# Altium schematic sheet Sheet.SchDoc
size A4; SheetNumber: 1; SheetTotal: 1
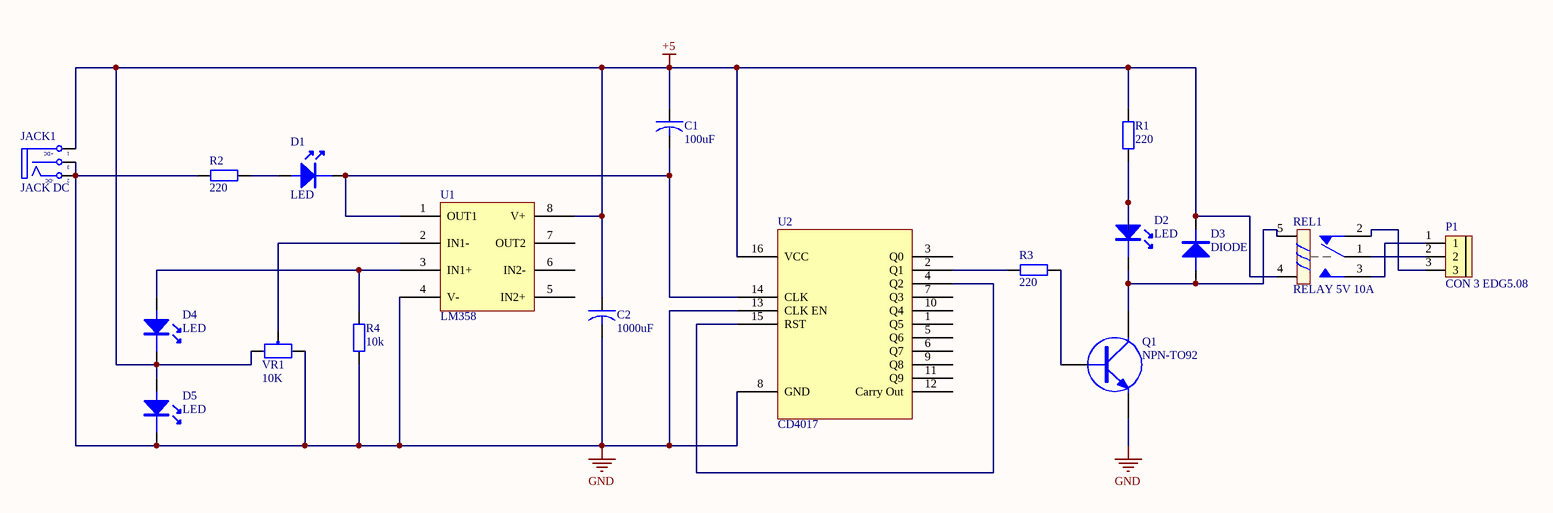
[diagram p0: Sheet.SchDoc]

## Parts
C1  100uF  [TU HOA 8mm]
C2  1000uF  [TU HOA 8mm]
D1  LED  [LED5MM RED]
D2  LED  [LED5MM RED]
D3  DIODE  [DIODE 1A]
D4  LED  [LED5MM RED]
D5  LED  [LED5MM RED]
JACK1  JACK DC  [JACK DC]
P1  CON 3 EDG5.08  [CON 3P 5.08MM]
Q1  NPN-TO92  [TO-92]
R1  220  [RESISTOR]
R2  220  [RESISTOR]
R3  220  [RESISTOR]
R4  10k  [RESISTOR]
REL1  RELAY 5V 10A  [RELAY 5V-10A]
U1  LM358  [DIP 8]
U2  CD4017  [PDIP16]
VR1  10K  [RVAR]

## Nets
+5: C1.1 C2.1 D3.2 D4.2 D5.1 JACK1.1(T) R1.1 REL1.4 U1.8(V+) U2.16(VCC) VR1.1
GND: C2.2 D5.2 JACK1.2(TN) JACK1.3(S) Q1.1(E) R2.1 R4.1 U1.4(V-) U2.8(GND) U2.13(CLK_EN) VR1.3
NetC1_2: C1.2 D1.2 U1.1(OUT1) U2.14(CLK)
NetD1_1: D1.1 R2.2
NetD2_1: D2.1 R1.2
NetD2_2: D2.2 D3.1 Q1.2(C) REL1.5
NetD4_1: D4.1 R4.2 U1.3(IN1+)
NetP1_1: P1.1 REL1.3
NetP1_2: P1.2 REL1.1
NetP1_3: P1.3 REL1.2
NetQ1_3: Q1.3(B) R3.2
NetR3_1: R3.1 U2.2(Q1)
NetU1_2: U1.2(IN1-) VR1.2
NetU2_4: U2.4(Q2) U2.15(RST)

Not connected (* = marked no-connect by the designer): U1 5(IN2+) 6(IN2-) 7(OUT2); U2 1(Q5) 3(Q0) 5(Q6) 6(Q7) 7(Q3) 9(Q8) 10(Q4) 11(Q9) 12(Carry_Out)

## Notes on the sheet
- (in symbol JACK DC) +DC; -DC

## Library data of the parts
C1 C2 = CAPACITOR
JACK1 = JACK DC: Value: Jac DC
P1 = CON 3 EDG5.08: Cắm; Ten_Linh_Kien: CON 3 2EDG5.08-3P 5.08MM ( Xanh Cong); Ma_Hang: MH000760; Ghi_Chu: *; Kieu_Chan: *; Don_Vi: Con; Chung_Loai: Cắm
R1-R4 = RESISTOR: Value: R1/4W - 1K
VR1 = VAR RES: Value: VR 10K